# EAGLE design AST2003 (EAGLE 6.3)
DATABASE: ./../../../../../Components/TinyCircuits_Part_Database.txt
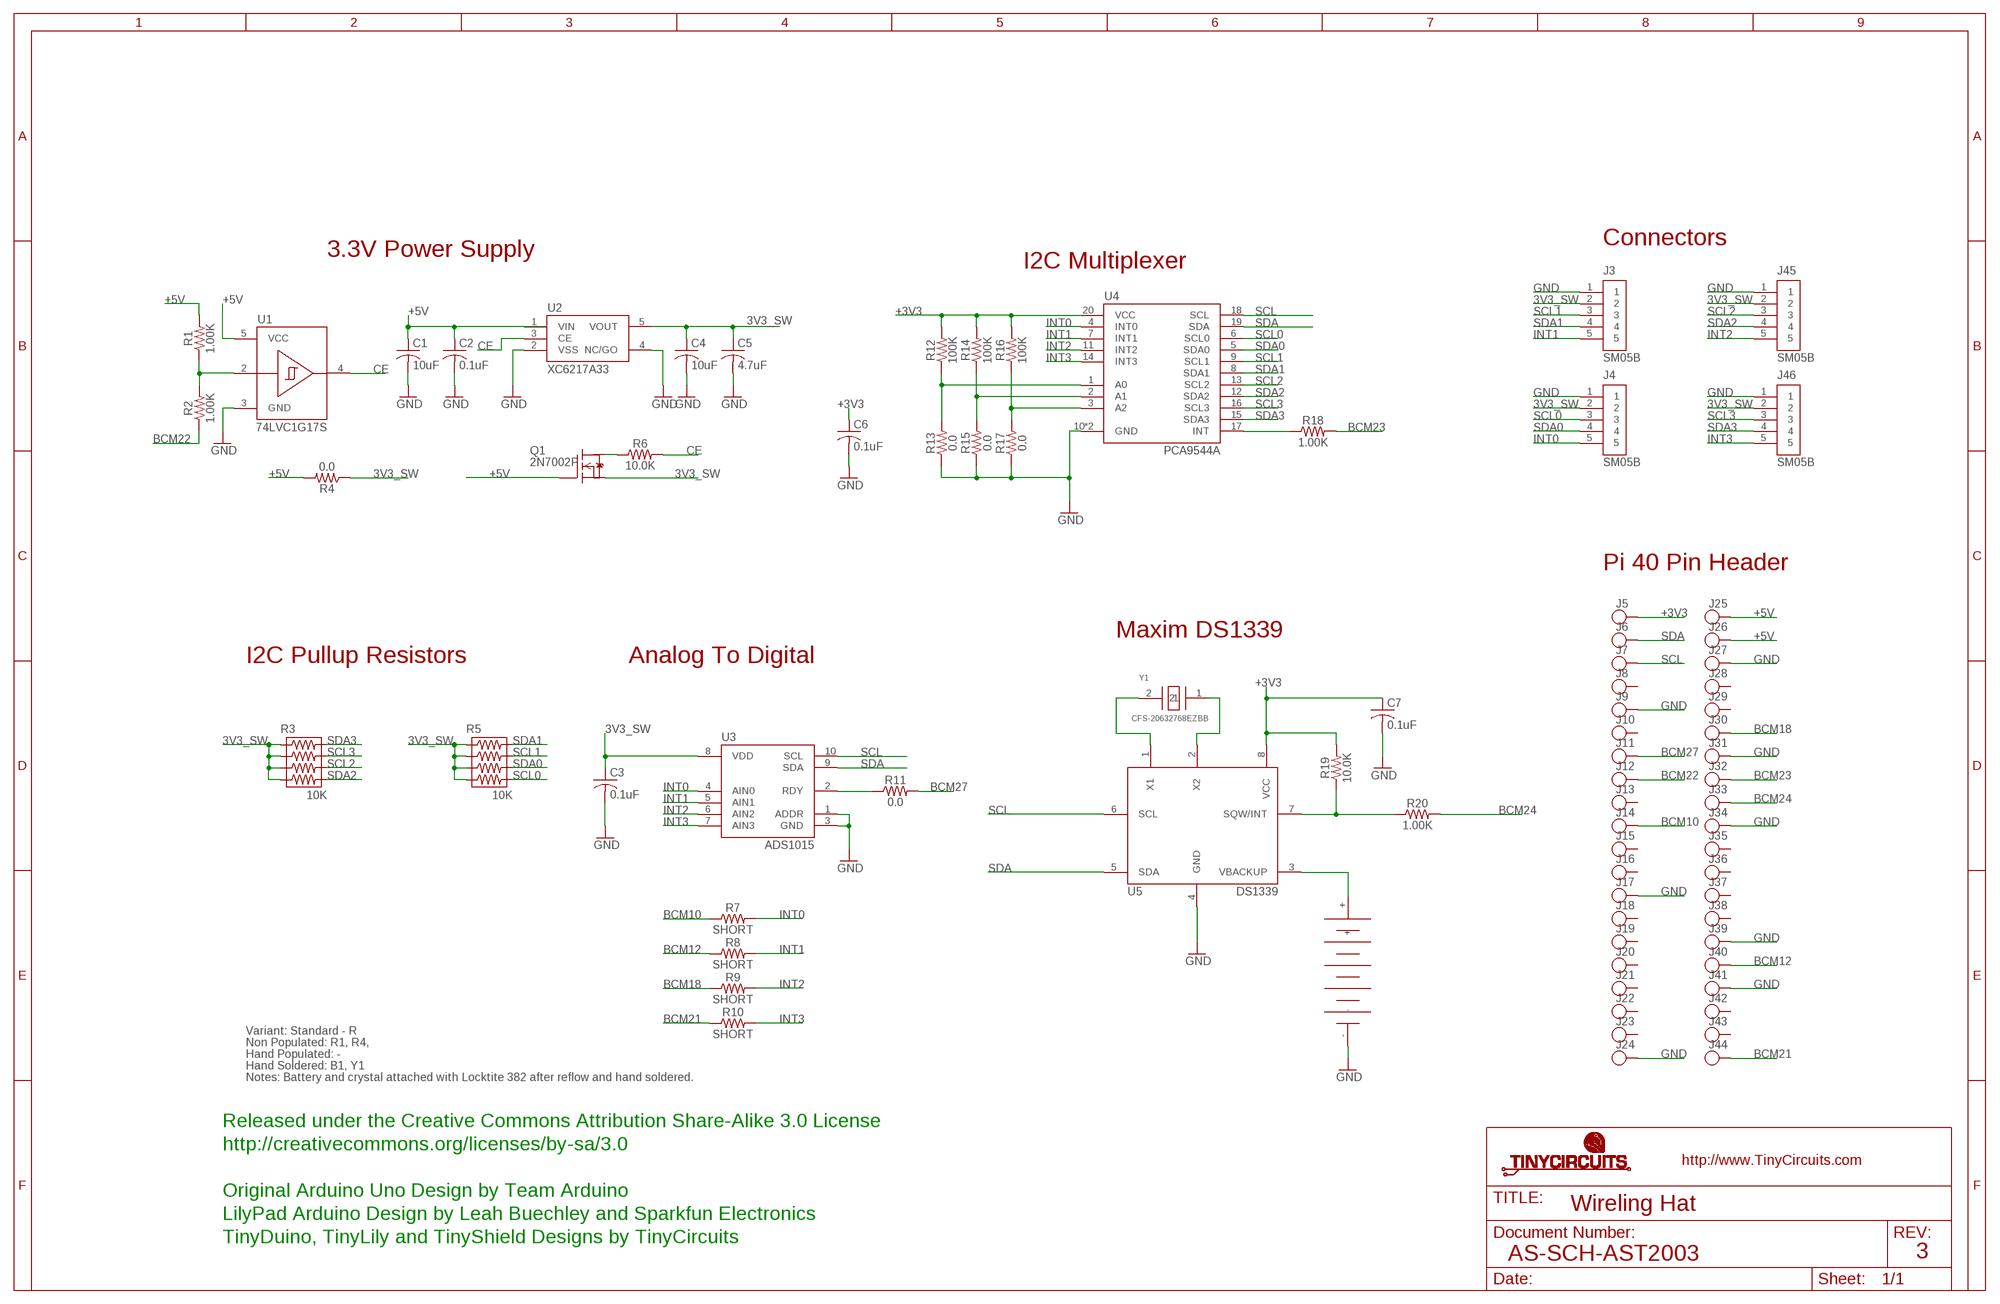
[diagram p0: schematic, sheet 1]

## Parts
B1  ML-920S/DN  AS-ITM-00182  [ML-920S/DN]
C1  10uF  AS-ITM-00002  [C0603]
C2  0.1uF  AS-ITM-00008  [C0402]
C3  0.1uF  AS-ITM-00008  [C0402]
C4  10uF  AS-ITM-00002  [C0603]
C5  4.7uF  AS-ITM-00242  [C0402]
C6  0.1uF  AS-ITM-00008  [C0402]
C7  0.1uF  AS-ITM-00008  [C0402]
J3  SM05B  AS-ITM-00340  [JST_SH_5X1]
J4  SM05B  AS-ITM-00340  [JST_SH_5X1]
J5  PIN_1X.1"1  [1X.1"_2]
J6  PIN_1X.1"1  [1X.1"_2]
J7  PIN_1X.1"1  [1X.1"_2]
J8  PIN_1X.1"1  [1X.1"_2]
J9  PIN_1X.1"1  [1X.1"_2]
J10  PIN_1X.1"1  [1X.1"_2]
J11  PIN_1X.1"1  [1X.1"_2]
J12  PIN_1X.1"1  [1X.1"_2]
J13  PIN_1X.1"1  [1X.1"_2]
J14  PIN_1X.1"1  [1X.1"_2]
J15  PIN_1X.1"1  [1X.1"_2]
J16  PIN_1X.1"1  [1X.1"_2]
J17  PIN_1X.1"1  [1X.1"_2]
J18  PIN_1X.1"1  [1X.1"_2]
J19  PIN_1X.1"1  [1X.1"_2]
J20  PIN_1X.1"1  [1X.1"_2]
J21  PIN_1X.1"1  [1X.1"_2]
J22  PIN_1X.1"1  [1X.1"_2]
J23  PIN_1X.1"1  [1X.1"_2]
J24  PIN_1X.1"1  [1X.1"_2]
J25  PIN_1X.1"1  [1X.1"_2]
J26  PIN_1X.1"1  [1X.1"_2]
J27  PIN_1X.1"1  [1X.1"_2]
J28  PIN_1X.1"1  [1X.1"_2]
J29  PIN_1X.1"1  [1X.1"_2]
J30  PIN_1X.1"1  [1X.1"_2]
J31  PIN_1X.1"1  [1X.1"_2]
J32  PIN_1X.1"1  [1X.1"_2]
J33  PIN_1X.1"1  [1X.1"_2]
J34  PIN_1X.1"1  [1X.1"_2]
J35  PIN_1X.1"1  [1X.1"_2]
J36  PIN_1X.1"1  [1X.1"_2]
J37  PIN_1X.1"1  [1X.1"_2]
J38  PIN_1X.1"1  [1X.1"_2]
J39  PIN_1X.1"1  [1X.1"_2]
J40  PIN_1X.1"1  [1X.1"_2]
J41  PIN_1X.1"1  [1X.1"_2]
J42  PIN_1X.1"1  [1X.1"_2]
J43  PIN_1X.1"1  [1X.1"_2]
J44  PIN_1X.1"1  [1X.1"_2]
J45  SM05B  AS-ITM-00340  [JST_SH_5X1]
J46  SM05B  AS-ITM-00340  [JST_SH_5X1]
Q1  2N7002P  AS-ITM-00110  [SOT-416]
R1  1.00K  AS-ITM-00003  [0402]
R2  1.00K  AS-ITM-00003  [0402]
R3  10K  AS-ITM-00520  [0402RPACK]
R4  0.0  AS-ITM-00076  [0402]
R5  10K  AS-ITM-00520  [0402RPACK]
R6  10.0K  AS-ITM-00032  [0402]
R7  SHORT  AS-ITM-000760402_SHORT  [0402_SHORT]
R8  SHORT  AS-ITM-000760402_SHORT  [0402_SHORT]
R9  SHORT  AS-ITM-000760402_SHORT  [0402_SHORT]
R10  SHORT  AS-ITM-000760402_SHORT  [0402_SHORT]
R11  0.0  AS-ITM-00076  [0402]
R12  100K  AS-ITM-00004  [0402]
R13  0.0  AS-ITM-00076  [0402]
R14  100K  AS-ITM-00004  [0402]
R15  0.0  AS-ITM-00076  [0402]
R16  100K  AS-ITM-00004  [0402]
R17  0.0  AS-ITM-00076  [0402]
R18  1.00K  AS-ITM-00003  [0402]
R19  10.0K  AS-ITM-00032  [0402]
R20  1.00K  AS-ITM-00003  [0402]
U1  74LVC1G17S  AS-ITM-00382  [SOT-353]
U2  XC6217A33  AS-ITM-00249  [SOT-25]
U3  ADS1015  AS-ITM-00383  [R-PQFP-N10]
U4  PCA9544A  AS-ITM-00342  [VQFN-20_4.5X3.5]
U5  DS1339  AS-ITM-00181  [8-USOP]
Y1  CFS-20632768EZBB  AS-ITM-00348  [CRYSTAL_1.9MM_TH]

## Nets
3V3_SW: C3.1 C4.1 C5.1 J3.2 J4.2 J45.2 J46.2 Q1.2(S) R3.1 R3.3 R3.5 R3.7 R4.1 R5.1 R5.3 R5.5 R5.7 U2.5(VOUT) U3.8(VDD)
+3V3: C6.1 C7.1 J5.1 R12.2 R14.2 R16.2 R19.2 U4.20(VCC) U5.8(VCC)
+5V: C1.1 C2.1 J25.1 J26.1 Q1.1(G) R1.2 R4.2 U1.5(VCC) U2.1(VIN)
BCM10: J14.1 R7.1
BCM12: J40.1 R8.1
BCM18: J30.1 R9.1
BCM21: J44.1 R10.1
BCM22: J12.1 R2.1
BCM23: J32.1 R18.2
BCM24: J33.1 R20.2
BCM27: J11.1 R11.2
CE: R6.2 U1.4(Y) U2.3(CE)
GND: B1.- C1.2 C2.2 C3.2 C4.2 C5.2 C6.2 C7.2 J3.1 J4.1 J9.1 J17.1 J24.1 J27.1 J31.1 J34.1 J39.1 J41.1 J45.1 J46.1 R13.1 R15.1 R17.1 U1.3(GND) U2.2(VSS) U2.4(NC/GO) U3.1(ADDR) U3.3(GND) U4.10(GND) U4.PAD(GND) U5.4(GND)
INT0: J4.5 R7.2 U3.4(AIN0) U4.4(INT0)
INT1: J3.5 R8.2 U3.5(AIN1) U4.7(INT1)
INT2: J45.5 R9.2 U3.6(AIN2) U4.11(INT2)
INT3: J46.5 R10.2 U3.7(AIN3) U4.14(INT3)
N$1: Q1.3(D) R6.1
N$2: R12.1 R13.2 U4.1(A0)
N$3: R16.1 R17.2 U4.3(A2)
N$4: R18.1 U4.17(INT)
N$6: R14.1 R15.2 U4.2(A1)
N$7: R11.1 U3.2(RDY)
N$15: R19.1 R20.1 U5.7(SQW/INT)
N$16: B1.+ U5.3(VBACKUP)
N$17: U5.1(X1) Y1.2
N$18: U5.2(X2) Y1.1
N$100: R1.1 R2.2 U1.2(A)
SCL: J7.1 U3.10(SCL) U4.18(SCL) U5.6(SCL)
SCL0: J4.3 R5.8 U4.6(SCL0)
SCL1: J3.3 R5.4 U4.9(SCL1)
SCL2: J45.3 R3.6 U4.13(SCL2)
SCL3: J46.3 R3.4 U4.16(SCL3)
SDA: J6.1 U3.9(SDA) U4.19(SDA) U5.5(SDA)
SDA0: J4.4 R5.6 U4.5(SDA0)
SDA1: J3.4 R5.2 U4.8(SDA1)
SDA2: J45.4 R3.8 U4.12(SDA2)
SDA3: J46.4 R3.2 U4.15(SDA3)
Unconnected: J8.1 J10.1 J13.1 J15.1 J16.1 J18.1 J19.1 J20.1 J21.1 J22.1 J23.1 J28.1 J29.1 J35.1 J36.1 J37.1 J38.1 J42.1 J43.1

## Notes on the sheet
- Connectors
- 3.3V Power Supply
- I2C Multiplexer
- Pi 40 Pin Header
- Maxim DS1339
- I2C Pullup Resistors | Analog To Digital
- Variant: Standard - R
- Non Populated: R1, R4,
- Hand Populated: -
- Hand Soldered: B1, Y1
- Notes: Battery and crystal attached with Locktite 382 after reflow and hand soldered.
- Released under the Creative Commons Attribution Share-Alike 3.0 License
- http://creativecommons.org/licenses/by-sa/3.0
- Original Arduino Uno Design by Team Arduino
- Wireling Hat
- LilyPad Arduino Design by Leah Buechley and Sparkfun Electronics
- TinyDuino, TinyLily and TinyShield Designs by TinyCircuits
- AS-SCH-AST2003 | 3

## Library data of the parts
B1 = tinycircuits:AS-ITM-00182: BATTERY LITH 3V RECHARGE SMD; PARTNO: AS-ITM-00182
C1 C4 = tinycircuits:AS-ITM-00002: CAP CER 10UF 10V 20% X5R 0603; PARTNO: AS-ITM-00002
C2 C3 C6 C7 = tinycircuits:AS-ITM-00008: CAP CER 0.1UF 16V 10% X5R 0402; PARTNO: AS-ITM-00008
C5 = tinycircuits:AS-ITM-00242: CAP CER 4.7UF 6.3V 20% X5R 0402; PARTNO: AS-ITM-00242
J3 J4 J45 J46 = tinycircuits:AS-ITM-00340: CONN HEADER SH 5POS SIDE 1MM TIN; PARTNO: AS-ITM-00340; PNPROTATION: 180
J5-J44 = tinycircuits:PIN_1X.1": 1 Pin 0.100" Header
Q1 = tinycircuits:AS-ITM-00110: MOSFET N-CH SGL 60V SOT-416; PARTNO: AS-ITM-00110; PNPROTATION: 270; VALUE: 2N7002PT
R1 R2 R18 R20 = tinycircuits:AS-ITM-00003: RES 1.00K OHM 1/16W 1% 0402; PARTNO: AS-ITM-00003
R3 R5 = tinycircuits:AS-ITM-00520: RES ARRAY 4 RES 10K OHM 0804; PARTNO: AS-ITM-00520
R4 R7-R11 R13 R15 R17 = tinycircuits:AS-ITM-00076: RES 0.0 OHM 1/16W 1% 0402 SMD; PARTNO: AS-ITM-00076
R6 R19 = tinycircuits:AS-ITM-00032: RES 10.0K OHM 1/16W 1% 0402 SMD; PARTNO: AS-ITM-00032
R12 R14 R16 = tinycircuits:AS-ITM-00004: RES 100K OHM 1/16W 1% 0402; PARTNO: AS-ITM-00004
U1 = tinycircuits:AS-ITM-00382: IC SGL SCHMITT BUFFER SOT353; PARTNO: AS-ITM-00382; PNPROTATION: 0
U2 = tinycircuits:AS-ITM-00249: IC REG LDO 3.3V 0.2A SOT25; PARTNO: AS-ITM-00249; PNPROTATION: 270
U3 = tinycircuits:AS-ITM-00383: IC ADC 12BIT I2C 3.3KSPS 10QFN; PARTNO: AS-ITM-00383
U4 = tinycircuits:AS-ITM-00342: IC I2C MUX 4CH BI-DIR 20-VQFN; PARTNO: AS-ITM-00342; PNPROTATION: 0
U5 = tinycircuits:AS-ITM-00181: IC RTC CLK/CALENDAR I2C 8-USOP; PARTNO: AS-ITM-00181
Y1 = tinycircuits:AS-ITM-00348: CRYSTAL 32.7680KHZ 6PF T/H; PARTNO: AS-ITM-00348

## Net classes
1 power: width 0.61 mm, drill 0.61 mm, clearance 0.254 mm
2 gnd: width 0.305 mm, drill 0.559 mm, clearance 0.254 mm
3 usbvcc: width 0.508 mm, drill 0.61 mm, clearance 0.254 mm
4 aref: width 0.406 mm, drill 0.61 mm, clearance 0.254 mm

## Board
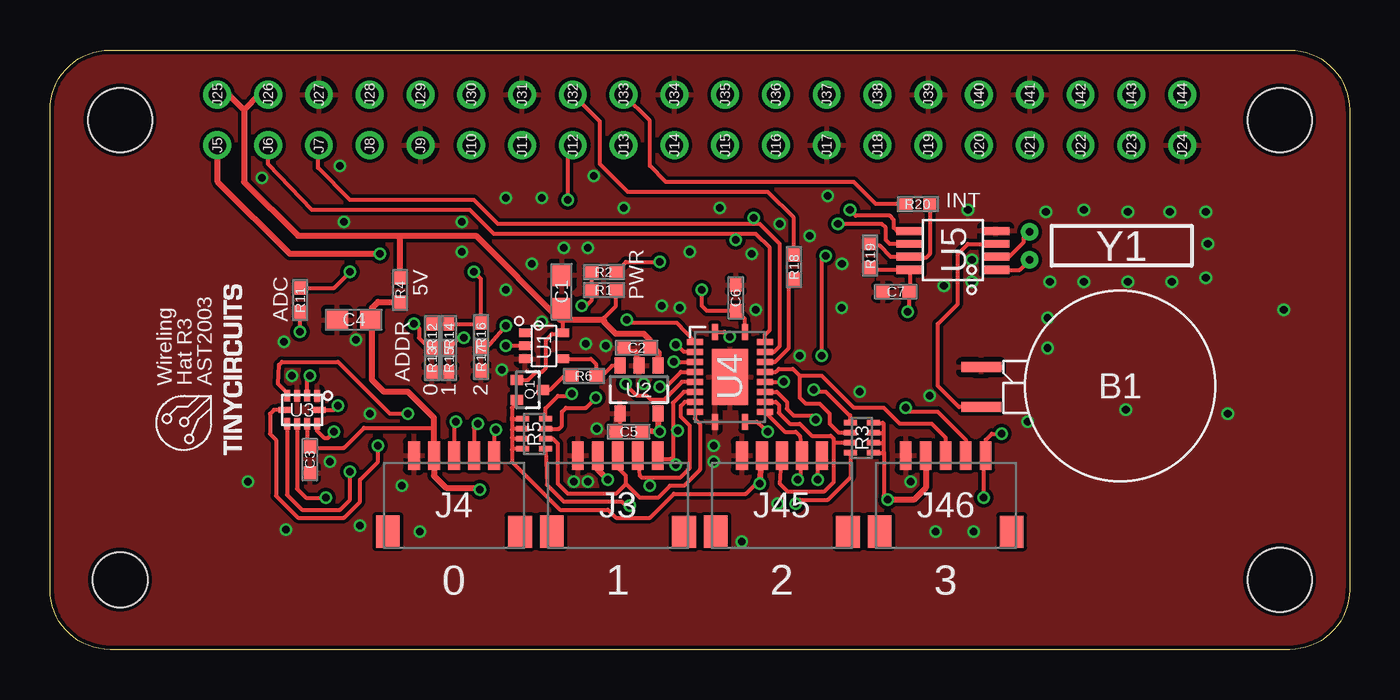
[diagram p1: board, top side]
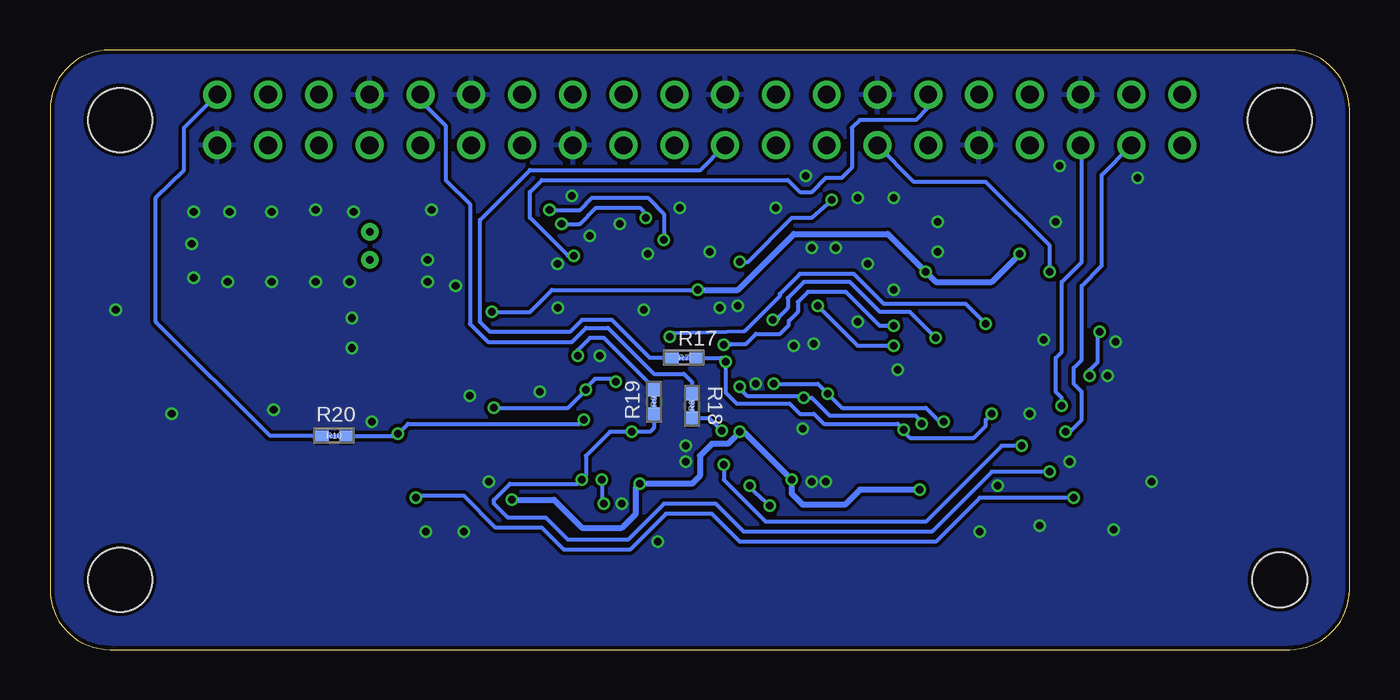
[diagram p2: board, bottom side, seen from below]

Size 65 x 30 mm. Coordinates in mm from the lower left corner, seen from the top.
Outline: 65,27 65,3 arc-90 62,0 3,0 arc-90 0,3 0,27 arc-90 3,30 62,30 arc-90 65,27
Copper layers (1*16): Top 0.035mm / dielectric 1.5mm / Bottom 0.035mm
Design rules "default *": minimum track width 8mil, minimum drill 15mil, track to track 7mil, track to pad 7mil, pad to pad 7mil, via to via 7mil, smd to smd 7mil, copper to edge 8mil, drill to drill 8mil, minimum pad ring 8mil, minimum via ring 5mil, stop-mask expansion 4mil, vias tented up to drill 25mil, thermal gap 10mil
Holes 3.2 mm at 61.5,26.5 61.5,3.5 3.5,26.5
Holes 2.75 mm at 3.5,3.5
tRestrict: 4 lines

### Footprints (pad centres in the part's own frame; a part is rotated, then mirrored left to right if it is on the bottom)
ML-920S/DN = smd 2 x 0.5: + 6.95,1.05; - 6.95,-0.95
C0603 = smd 1.1 x 1: 1 -0.85,0; 2 0.85,0
C0402 = smd 0.65 x 0.6: 1 -0.65,0; 2 0.65,0
JST_SH_5X1 = smd 0.6 x 1.4: 1 -2,2.475; 2 -1,2.475; 3 0,2.475; 4 1,2.475; 5 2,2.475 | smd 1.2 x 1.6: PAD1 -3.3,-1.325; PAD2 3.3,-1.325
1X.1"_2 = drill 0.889 pad 1.397: 1 0,0
SOT-416 = smd 0.5 x 0.6: 1 -0.5,-0.65; 2 0.5,-0.65; 3 0,0.65
0402 = smd 0.65 x 0.55: 1 -0.6,0; 2 0.6,0
0402RPACK = smd 0.3 x 0.65: 1 -0.75,0.575; 2 -0.75,-0.575; 3 -0.25,0.575; 4 -0.25,-0.575; 5 0.25,0.575; 6 0.25,-0.575; 7 0.75,0.575; 8 0.75,-0.575
0402_SHORT = smd 0.65 x 0.55: 1 -0.6,0; 2 0.6,0
SOT-353 = smd 0.42 x 0.6: 1 -0.65,-0.95; 2 0,-0.95; 3 0.65,-0.95; 4 0.65,0.95; 5 -0.65,0.95
SOT-25 = smd 0.55 x 0.8: 1 -0.95,-1.2; 2 0,-1.2; 3 0.95,-1.2; 4 0.95,1.2; 5 -0.95,1.2
R-PQFP-N10 = smd 0.3 x 0.58: 1 -0.75,-0.7; 2 -0.25,-0.7; 3 0.25,-0.7; 4 0.75,-0.7; 6 0.75,0.7; 7 0.25,0.7; 8 -0.25,0.7; 9 -0.75,0.7 | smd 0.63 x 0.3: 5 0.86,0; 10 -0.86,0
VQFN-20_4.5X3.5 = smd 0.8 x 0.3: 1 -2.25,-0.75; 10 2.25,-0.75; 11 2.25,0.75; 20 -2.25,0.75 | smd 0.3 x 0.8: 2 -1.75,-1.75; 3 -1.25,-1.75; 4 -0.75,-1.75; 5 -0.25,-1.75; 6 0.25,-1.75; 7 0.75,-1.75; 8 1.25,-1.75; 9 1.75,-1.75; 12 1.75,1.75; 13 1.25,1.75; 14 0.75,1.75; 15 0.25,1.75; 16 -0.25,1.75; 17 -0.75,1.75; 18 -1.25,1.75; 19 -1.75,1.75 | smd 2.8 x 1.8: PAD 0,0
8-USOP = smd 0.4 x 1.35: 1 -1,-2.1; 2 -0.35,-2.1; 3 0.3,-2.1; 4 0.95,-2.1; 5 0.95,2.2; 6 0.3,2.2; 7 -0.35,2.2; 8 -1,2.2
CRYSTAL_1.9MM_TH = drill 0.381 pad 0.889: 1 -0.7,0; 2 0.7,0

### Placement (x,y rotation side)
B1  53.53,13.18 180 top
C1  25.6,17.9 90 top
C2  29.35,15.1 180 top
C3  13,9.5 270 top
C4  15.2,16.5 180 top
C5  28.95,10.9 180 top
C6  34.3,17.6 90 top
C7  42.31,17.9 180 top
J3  28.4,7.23 0 top
J4  20.2,7.23 0 top
J5  8.37,25.23 90 top
J6  10.91,25.23 90 top
J7  13.45,25.23 90 top
J8  15.99,25.23 90 top
J9  18.53,25.23 90 top
J10  21.07,25.23 90 top
J11  23.61,25.23 90 top
J12  26.15,25.23 90 top
J13  28.69,25.23 90 top
J14  31.23,25.23 90 top
J15  33.77,25.23 90 top
J16  36.31,25.23 90 top
J17  38.85,25.23 90 top
J18  41.39,25.23 90 top
J19  43.93,25.23 90 top
J20  46.47,25.23 90 top
J21  49.01,25.23 90 top
J22  51.55,25.23 90 top
J23  54.09,25.23 90 top
J24  56.63,25.23 90 top
J25  8.37,27.77 90 top
J26  10.91,27.77 90 top
J27  13.45,27.77 90 top
J28  15.99,27.77 90 top
J29  18.53,27.77 90 top
J30  21.07,27.77 90 top
J31  23.61,27.77 90 top
J32  26.15,27.77 90 top
J33  28.69,27.77 90 top
J34  31.23,27.77 90 top
J35  33.77,27.77 90 top
J36  36.31,27.77 90 top
J37  38.85,27.77 90 top
J38  41.39,27.77 90 top
J39  43.93,27.77 90 top
J40  46.47,27.77 90 top
J41  49.01,27.77 90 top
J42  51.55,27.77 90 top
J43  54.09,27.77 90 top
J44  56.63,27.77 90 top
J45  36.6,7.23 0 top
J46  44.8,7.23 0 top
Q1  24,13 270 top
R1  27.7,18 0 top
R2  27.7,18.9 180 top
R3  40.6,10.6 270 top
R4  17.5,18 90 top
R5  24.2,10.8 90 top
R6  26.7,13.7 0 top
R7  33.3,14.6 0 bottom
R8  32.9,12.2 270 bottom
R9  34.8,12.4 270 bottom
R10  50.8,10.7 0 bottom
R11  12.5,17.5 90 top
R12  19.1,15.7 90 top
R13  19.1,14.5 90 top
R14  19.95,15.7 90 top
R15  19.95,14.5 90 top
R16  21.55,15.75 90 top
R17  21.55,14.55 90 top
R18  37.2,19.15 90 top
R19  41.01,19.7 270 top
R20  43.4,22.3 180 top
U1  24.7,15.2 270 top
U2  29.46,13 180 top
U3  12.6,12 180 top
U4  34,13.65 270 top
U5  45.21,20 90 top
U$1  [DOCFIELD-TINYCIRCUITS-PCB]  78,-13 0 top  (outside the outline)
Y1  49,20.2 270 top

### Tracks (layer width: path | path; a pad name or v marks a point on that pad's centre or on a via)
3V3_SW  (via drill 0.38)
  Top 0.203: 23.15,11.55 23.1,11.5 23.1,11 | 23.1,11 23.1,10.6 | 23.1,10.6 23.1,10 | R5.5 23.15,11.05 23.1,11 | R5.3 23.15,10.55 23.1,10.6 | R5.1 23.15,10.05 23.1,10 | 23.1,10 23.1,9.4 25.5,7 27.9,7 28.3,6.6 30,6.6 31.2,7.8 34.8,7.8 35.3,8.3 v35.5,8.3 | R3.7 41.65,9.85 41.7,9.9 | 41.7,9.9 41.7,10.4 | 41.7,10.4 41.7,10.8 | 41.7,10.8 41.7,11.3 41.65,11.35 R3.1 | R3.5 41.65,10.35 41.7,10.4 | R3.3 41.65,10.85 41.7,10.8 | 41.7,9.9 41.7,7.7 v41.9,7.5 | 23.15,11.55 23.1,11.6 23.1,12.1 23.5,12.5 Q1.2 | 23.15,11.55 R5.7 | C3.1 12.85,10.3 U3.8 12.85,10.25 13,10.1 14.7,10.1 15.7,11.1 19.2,11.1 | C4.1 16.1,16.5
  Top 0.305: v35.5,8.3 J45.2 | J46.2 43.8,8.1 43.2,7.5 v41.9,7.5 | U2.5 30.41,10.99 v30.5,10.9 29.7,11 C5.1 | v27.9,8.5 27.4,9 J3.2 | v21.5,8 21.4,8.1 19.8,8.1 19.2,8.7 J4.2 19.2,11.1 19.2,11.6 17.9,12.9 16.7,12.9 16.1,13.5 16.1,16.5 16.1,17.1 16.4,17.4 R4.1
  Bottom 0.305: v41.9,7.5 39.8,7.5 38.4,6.1 36.4,6.1 35.7,6.8 35.7,8.1 v35.5,8.3 32.9,8.3 32.5,8.7 32.5,9.7 31.9,10.3 31.1,10.3 v30.5,10.9 30.4,11 v27.9,8.5 27.9,7.8 27.35,7.25 25.25,7.25 24.5,8 v21.5,8
+3V3  (via drill 0.38)
  Top 0.203: U4.20 34.75,16.55 34.35,16.95 C6.1 32.85,16.95 32.6,17.2 v32.6,18 | R12.2 R14.2 21.5,16.3 R16.2 21.55,18.55 v21.2,18.9 | R19.2 41.11,19 U5.8 43.01,17.95 C7.1 42.96,16.96 v42.9,16.9
  Top 0.305: v16.5,19.8 12,19.8 8.4,23.4 8.4,25.2 J5.1
  Bottom 0.203: v42.9,16.9 41,16.9 39.9,18 v32.6,18
  Bottom 0.305: v32.6,18 30.6,18 27.8,20.8 23.1,20.8 v21.2,18.9 20.7,18.4 17.9,18.4 v16.5,19.8
+5V
  Top 0.203: C1.1 25.5,16.5 25.65,16.35 U1.5 25.6,15.8 25.1,15.8 24.8,15.5 24.8,14.1 24.6,13.9 24.3,13.9 23.9,13.5 Q1.1 | 27.7,16.5 27.7,16.6 28.3,17.2 R1.2
  Top 0.305: U2.1 30.46,14.84 30.3,15 C2.1 30,15.5 29.7,15.8 28.3,15.8 27.75,16.35 27.7,16.5 25.5,16.5 21.3,20.7 17.5,20.7 | J26.1 10.47,27.77 9.7,27 | 9.7,27 9.7,23.4 12.4,20.7 17.5,20.7 | J25.1 8.93,27.77 9.7,27 | R4.2 17.5,20.7
BCM10
  Bottom 0.203: R7.1 35,14.6 36.9,16.5 38.4,16.5 39,15.9 43,15.9 43.5,16.4 43.5,21.5 41,24 32.46,24 J14.1
BCM12
  Bottom 0.203: J40.1 46.47,27.47 45.2,26.2 45.2,23.5 44,22.3 44,16.3 43.1,15.4 38.9,15.4 38.2,16.1 37.1,16.1 34.8,13.8 33.3,13.8 32.9,13.4 R8.1
BCM18  (via drill 0.38)
  Top 0.203: v38.6,14.7 38.6,19.5 v38.8,19.7
  Bottom 0.203: R9.1 34.8,13.1 37.3,15.6 38,15.6 38.6,15 v38.6,14.7 | v38.8,19.7 39.1,19.7 41,21.6 41,22.9 40.4,23.5 28.1,23.5 27.5,22.9 26.9,22.9 26.2,23.6 25.4,23.6 24.9,24.1 24.9,26.1 24.5,26.5 21.7,26.5 21.07,27.13 J30.1
BCM21
  Bottom 0.203: R10.1 54,10.7 59.7,16.4 59.7,22.6 58.3,24 58.3,26.1 J44.1
BCM22  (via drill 0.38)
  Top 0.203: R2.1 28.8,19.4 v30.5,19.4 | v25.9,22.5 25.9,24.98 J12.1
  Bottom 0.203: v30.5,19.4 30.1,19.4 27.9,21.6 26.9,21.6 v25.9,22.5
BCM23
  Top 0.203: R18.2 37.2,21.6 35.9,22.9 28.9,22.9 27.5,24.3 27.5,26.42 J32.1
BCM24
  Top 0.203: R20.2 41.3,22.3 40.2,23.4 30.8,23.4 30,24.2 30,26.46 J33.1
BCM27  (via drill 0.38)
  Top 0.203: R11.2 14.2,18.1 v15,18.9
  Bottom 0.203: v15,18.9 15,20.2 18.2,23.4 21.78,23.4 J11.1
CE
  Top 0.203: U2.3 28.1,14.2 27.6,13.7 R6.2 27.3,14.3 27.05,14.55 U1.4
GND  (via drill 0.38)
  Top 0.203: U2.4 28.56,11.46 28.5,11.4 28.45,11.1 C5.2 | C2.2 28.85,14.95 29.3,14.95 29.3,14.7 29.46,14.54 U2.2
  other vias: 22.8,18 26.9,8.4 29.7,13.3 26.2,8.4 27.35,11.05 33.2,10.2 33.2,9.4 27.8,15.2 43.05,8.4 22.6,14 25.7,20.1 24.1,19.3 20.6,19.9 30.6,17.2 31.5,17.1 35.3,17 40.5,12.9 46.2,5.9 44.3,5.9 18.5,5.9 12.1,13.7 14,9.4 16,11.8 17.6,8.2 15.5,6.2 10.6,23.6 14.7,21.4 20.6,21.4 44,12.7 48.9,11.4 15.3,15.5 11.7,15.4 11.8,6 34.6,5.4 24.6,16.4 26.9,20.1 36.5,21.3 28.7,22.1 24.6,22.6 14.5,24.2 37.5,14.7 39.6,17.1 38,20.7 27.2,23.7 22.8,22.6 61.71,17 46.11,19.5 50.01,18.4 51.71,18.4 53.91,18.4 56.11,18.4 57.81,18.6 57.91,20.3 57.81,21.9 56.01,21.9 53.91,21.9 51.71,22 49.81,21.9 45.91,22 39.61,19.3 49.9,15.09 49.9,16.59 44.71,18.2 46.11,18.4 35.1,19.8 32,19.9 33.5,22.1 38.9,22.7 26.8,15.3 58.91,11.8 53.81,12 9.9,8.4 36.4,7.3
  pour Bottom (rank 2): 0,30 65,30 65,0 0,0
  pour Top (rank 2): 0,30 65,30 65,0 0,0
INT0  (via drill 0.38)
  Top 0.203: v31.2,14.4 U4.4 | v22.3,11 22.2,10.9 J4.5 | U3.4 11.85,12.85 11.4,13.3 11.45,14.25 11.6,14.4 14.4,14.4 17,11.8 v17.9,11.8
  Bottom 0.203: v17.9,11.8 18.2,11.5 18.2,11.2 18.8,10.6 22,10.6 22.3,10.9 v22.3,11 22.6,11.3 26.3,11.3 26.8,11.8 27.5,11.8 28,12.3 30.65,12.3 31.2,12.85 v31.2,14.4 31.4,14.6 R7.2
INT1  (via drill 0.38)
  Top 0.203: U4.7 31.7,12.9 31.15,12.35 31.15,11 | 31.15,11 31.15,9.45 | J3.5 30.65,9.55 31.05,9.55 31.15,9.45 | 31.15,9.45 31.3,9.3 v31.3,9.25 31.15,9.45 | U3.5 11.2,12 11,11.8 11,10.8 11.3,10.5 11.3,7.7 12.4,6.6 14.7,6.6 15.5,7.4 15.5,8.5 16.4,9.4 v16.4,10.2 | 31.15,11 v31.4,10.95
  Bottom 0.203: v31.3,9.25 31.3,8.5 29.2,6.4 21.2,6.4 17.4,10.2 v16.4,10.2 | R8.2 32.05,11.6 v31.4,10.95
INT2  (via drill 0.38)
  Top 0.203: U4.11 35.35,11.4 v35.9,10.9 | v38.4,8.5 38.4,9.6 J45.5 | U3.6 11.85,7.75 12.6,7 14.5,7 15,7.5 v15,8.9
  Bottom 0.203: v15,8.9 17.9,8.9 20.9,5.9 30.3,5.9 31.7,7.3 34.3,7.3 36.1,5.5 39.1,5.5 40.2,6.6 42.1,6.6 42.8,7.3 42.8,7.5 42,8.3 38.6,8.3 v38.4,8.5 38.2,8.7 38.2,9.7 37,10.9 v35.9,10.9 35,10.9 34.8,11.1 R9.2
INT3  (via drill 0.38)
  Top 0.203: U4.14 36.35,12.9 36.85,12.4 36.85,12.05 37.2,11.7 38.1,11.7 v38.3,11.5 | v47.6,10.8 47.1,10.8 46.8,10.5 J46.5 46.7,9.6 v46.7,7.6 | U3.7 12.35,8.05 12.8,7.6 v13.8,7.6
  Bottom 0.203: v38.3,11.5 38.5,11.3 47.1,11.3 v47.6,10.8 47.7,10.7 R10.2 | v13.8,7.6 18.5,7.6 20.7,5.4 30.5,5.4 31.9,6.8 34.2,6.8 36,5 39.3,5 40.4,6.1 42.7,6.1 44.3,7.7 46.6,7.7 v46.7,7.6
N$1
  Top 0.203: R6.1 25.8,13.8 25,13 Q1.3
N$2  (via drill 0.38)
  Top 0.203: U4.1 33.75,15.9 v34,15.65 | v18.2,16.3 18.45,16.1 18.45,15.6 18.95,15.1 R12.1
  Bottom 0.203: v34,15.65 33.85,15.85 30.25,15.95 28.5,17.7 28.5,17.8 27.5,18.8 24.8,18.8 23.3,17.3 19.2,17.3 v18.2,16.3 18.3,16.2
N$3  (via drill 0.38)
  Top 0.203: U4.3 31.7,14.9 31.5,15.1 31.45,15.1 v31.3,15.25 | v22.8,16.2 22,15.3 21.85,15.15 R16.1
  Bottom 0.203: v31.3,15.25 31,15.25 30.95,15.3 30.2,15.3 29.7,15.8 28.5,15.8 28.05,16.25 28.05,16.45 27.6,16.9 27.6,17.4 27.1,17.9 25.2,17.9 23.5,16.2 v22.8,16.2
N$4
  Top 0.203: U4.17 36.25,14.4 36.95,15.1 36.95,18.3 R18.1
N$6  (via drill 0.38)
  Top 0.203: U4.2 31.35,16.35 29,16.35 v28.85,16.5 | v20.7,15.6 20.5,15.65 R14.1
  Bottom 0.203: v28.85,16.5 28.7,16.55 28.6,16.55 28.55,16.6 28.55,16.65 28.1,17.1 28.1,17.6 27.3,18.4 25,18.4 23.5,16.9 22,16.9 v20.7,15.6
N$7  (via drill 0.38)
  Top 0.203: U3.2 12.85,13.65 v13,13.7 | v12.5,15.9 R11.1
  Bottom 0.203: v13,13.7 13,14 12.6,14.4 12.6,15.8 v12.5,15.9
N$15
  Top 0.203: R19.1 41.11,20.2 41.51,20.2 42.06,19.65 U5.7 43.06,19.6 43.81,19.6 44.01,19.8 R20.1
N$16
  Top 0.203: B1.+ 45.47,12.13 44.4,13.2 44.4,16.3 45.4,17.3 45.4,17.29 45.41,19.8 45.91,20.3 U5.3
N$17
  Top 0.203: U5.1 48.51,19 Y1.2
N$18
  Top 0.203: U5.2 47.95,19.65 48.7,20.4 48.7,20.59 Y1.1
N$100  (via drill 0.38)
  Top 0.203: v26.6,17.2 26.8,17.2 27.1,17.5 R1.1 R2.2 | U1.2 v22.8,15.2
  Bottom 0.203: v22.8,15.2 24.6,15.2 v26.6,17.2
SCL  (via drill 0.38)
  Top 0.203: U3.10 14.2,12 v14.4,12.2 | U4.18 36.2,14.9 36.5,15.2 36.5,20.3 35.5,21.3 35.2,21.3 | 35.2,21.3 22.4,21.3 21.2,22.5 15,22.5 13.4,24.1 13.4,25.18 J7.1 | U5.6 42.01,20.3 41.81,20.5 41.81,21.1 41.61,21.3 v39.41,21.3 | v35.2,21.6 35.2,21.3
  Bottom 0.203: v14.4,12.2 14.4,12.6 14.7,12.9 14.7,14.6 14.4,14.9 14.4,18.4 13.4,19.4 13.4,24.48 J7.1 | v39.41,21.3 38.5,21.3 37.7,22.1 35.5,22.1 35.2,21.8 v35.2,21.6
SCL0  (via drill 0.38)
  Top 0.203: U4.6 31.6,13.4 30.7,12.5 30.05,12.5 29.85,12.7 29.35,12.7 28.95,13.1 v28.8,13.3 | v20.3,11.4 20.2,11.3 J4.3 | v26.1,12.8 26,12.7 25.4,12.7 24.77,12.07 R5.8
  Bottom 0.203: v28.8,13.3 26.6,13.3 v26.1,12.8 25.4,12.1 21.2,12.1 20.5,11.4 v20.3,11.4
SCL1
  Top 0.203: U4.9 32.25,11.55 32.5,11.3 32.5,9 31.7,8.2 31,8.2 30.4,7.6 29.5,7.6 28.8,8.3 | J3.3 28.5,9 28.8,8.7 28.8,8.3 | 28.8,8.3 28.3,7.8 25.9,7.8 25.4,8.3 25.4,10.3 25.15,10.55 R5.4
SCL2
  Top 0.203: U4.13 36.3,12.4 36.45,12.25 36.45,11.85 37,11.3 37.5,11.3 38.1,10.7 39.05,10.7 39.2,10.55 39.2,10.35 | J45.3 36.5,8.3 36.9,7.9 38.7,7.9 39.2,8.4 39.2,10.35 | R3.6 39.2,10.35
SCL3
  Top 0.203: U4.16 36.3,13.9 36.45,14.05 37.15,14.05 37.5,13.7 | R3.4 39.45,10.85 39,11.3 39,11.8 38.5,12.3 37.8,12.3 37.5,12.6 37.5,13.7 | J46.3 44.8,10.6 44.1,11.3 42.5,11.3 41.7,12.1 40.2,12.1 38.6,13.7 37.5,13.7
SDA  (via drill 0.38)
  Top 0.203: U3.9 13.35,10.95 13.7,10.6 13.9,10.6 v14.2,10.9 | U4.19 35.75,15.75 36,16 36,20.1 35.3,20.8 34.2,20.8 | 34.2,20.8 22.2,20.8 21,22 13.1,22 10.9,24.3 J6.1 | U5.5 42.36,20.95 42.21,21.1 42.21,21.5 42.01,21.7 40.31,21.7 v40.01,22 | v34.3,20.5 34.3,20.7 34.2,20.8
  Bottom 0.203: v14.2,10.9 14,10.9 13.4,11.5 13.4,12.9 13.8,13.3 13.8,14.1 13.4,14.5 13.4,18.2 12.4,19.2 12.4,23.74 J6.1 | v40.01,22 38.5,22 37.9,22.6 35.1,22.6 34.3,21.8 v34.3,20.5
SDA0  (via drill 0.38)
  Top 0.203: U4.5 31.55,13.9 30.75,13.1 30.55,13.1 v30.5,13.15 | v21.4,11.3 21.2,11.1 J4.4 | R5.6 25.45,11.05 25.6,11.2 25.6,11.9 25.8,12.1 26.8,12.1 v27.3,12.6
  Bottom 0.203: v30.5,13.15 30.4,13.15 30.4,12.95 30.15,12.7 27.1,12.7 v27.3,12.6 26.9,12.6 26,11.7 21.7,11.7 21.4,11.4 v21.4,11.3
SDA1  (via drill 0.38)
  Top 0.203: U4.8 31.75,12.4 31.55,12.2 31.55,11.65 32,11.2 32,9.1 31.9,9 31.5,8.6 30,8.6 | 30,8.6 29.6,8.6 29.5,8.7 J3.4 | v29,7.2 28.8,7.2 28.6,7.4 25.7,7.4 24.85,8.25 R5.2 | v30,8.2 30,8.6
  Bottom 0.203: v30,8.2 30,8.1 v29,7.2
SDA2  (via drill 0.38)
  Top 0.203: U4.12 36.75,10.9 37.3,10.9 37.5,10.7 J45.4 37.5,8.6 v37.4,8.5 | v37.3,7.3 37.5,7.5 38.9,7.5 40.02,8.62 R3.8
  Bottom 0.203: v37.4,8.5 37.4,7.4 v37.3,7.3
SDA3  (via drill 0.38)
  Top 0.203: U4.15 v36.7,13.4 36.75,13.55 | R3.2 40.02,11.73 39.98,11.73 38.8,12.9 38.3,12.9 v38.2,13 | J46.4 45.8,10.5 44.4,11.9 43,11.9 v42.8,12.1
  Bottom 0.203: v36.7,13.4 36.7,13.5 36.75,13.55 37.75,13.55 38.2,13.1 v38.2,13 39.1,12.1 v42.8,12.1

### Text on the board
tPlace: INT | 5V | PWR | ADC | Wireling | Hat R3 | AST2003 | ADDR | 0 | 1 | 2 | 0 | 1 | 2 | 3
bPlace: R17 | R18 | R19 | R20
Document: FABRICATION DRAWING | NOTES: | 1. PRINTED CIRCUIT BOARD MADE FROM NEMA GRADE FR-4 EPOXY LAMINATE | WITH 1 OUNCE COPPER PLATING AND .024 THICKNESS. | 2. ALL DIMENSIONS ARE GIVEN IN MILLIMETERS. | 3. CIRCUIT PATHS ARE FOR REFERENCE ONLY. | 4. HOLE SIZES SHOWN ARE FINISHED DIAMETERS AFTER PLATING. | 5. BOARD PLATED USING REFLOW OR SIMILAR METHOD. | 6. BOARD TO HAVE BLUE SOLDER MASK ON PLATED SURFACES USING WET FILM | 7. SILKSCREEN BOARD USING WHITE INK. | SR100 OR SR1010 EPOXY. EQUIVALENT WET OR DRY FILM MAY BE USED. | 8. THE FOLLOWING INFORMATION APPLIES TO THIS BOARD: | * 2 COPPER LAYERS | * .024 BOARD THICKNESS | * REQUIRES TOP SIDE SILKSCREEN | Released under the Creative Commons Attribution Share-Alike 3.0 License | http://creativecommons.org/licenses/by-sa/3.0 | Original Arduino Uno Design by Team Arduino | LilyPad Arduino Design by Leah Buechley and Sparkfun Electronics | TinyDuino, TinyLily and TinyShield Designs by TinyCircuits | Wireling Hat | AS-PCB-AST2003 | 3